# Altium schematic sheet Snap-Off.SchDoc
size A; SheetNumber: 8; SheetTotal: 8
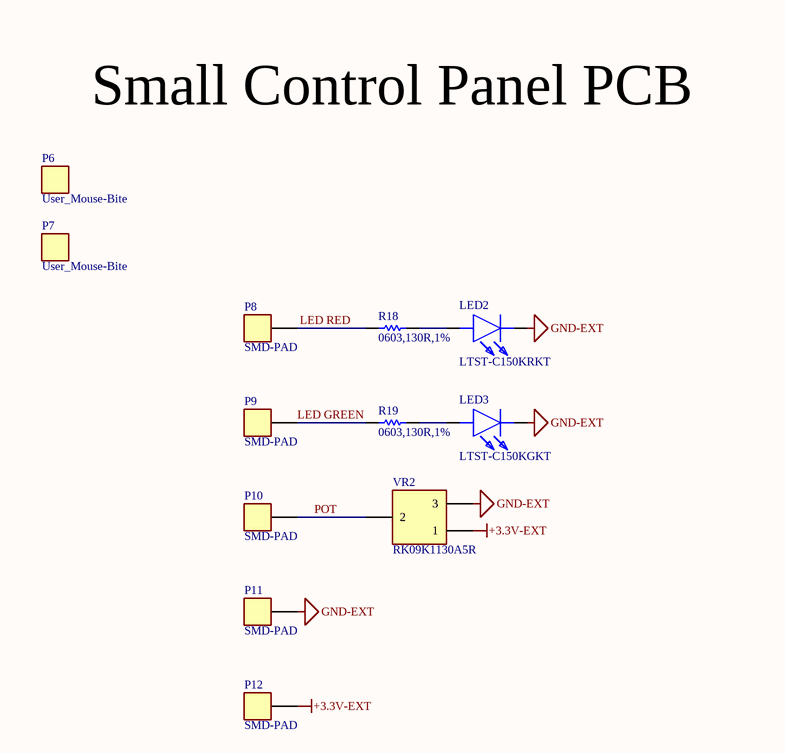
[diagram p0: Snap-Off.SchDoc]

## Parts
LED2  LTST-C150KRKT  [LEDC3216X120N]
LED3  LTST-C150KGKT  [LEDC3216X120N]
P6  User_Mouse-Bite  [mouse-bite-3mm-slot]  (no BOM)
P7  User_Mouse-Bite  [mouse-bite-3mm-slot]  (no BOM)
P8  SMD-PAD  [USER_SMD-PAD]  (no BOM)
P9  SMD-PAD  [USER_SMD-PAD]  (no BOM)
P10  SMD-PAD  [USER_SMD-PAD]  (no BOM)
P11  SMD-PAD  [USER_SMD-PAD]  (no BOM)
P12  SMD-PAD  [USER_SMD-PAD]  (no BOM)
R18  0603,130R,1%  [RESC1608X55N]
R19  0603,130R,1%  [RESC1608X55N]
VR2  RK09K1130A5R  [RES-ADJ-TH_RK09D1130C4G]

## Nets
+3.3V-EXT: P12.1 VR2.1
GND-EXT: LED2.1(K) LED3.1(K) P11.1 VR2.3
LED GREEN: P9.1 R19.1
LED RED: P8.1 R18.1
POT: P10.1 VR2.2
NetLED2_2: LED2.2(A) R18.2
NetLED3_2: LED3.2(A) R19.2

## Notes on the sheet
- (near P6) Small Control Panel PCB

## Library data of the parts
LED2 = LTST-C150KRKT: 20mA 54mcd Water Clear -30℃~+85℃ 624nm Red 130° 62.5mW 2V 1206 LED Indication - Discrete ROHS; Manufacturer_Name: Lite-On; Datasheet Link: https://optoelectronics.liteon.com/upload/download/DS-22-99-0149/LTST-C150KRKT.pdf; Height: 1.2mm; Manufacturer_Part_Number: LTST-C150KRKT; Mouser Part Number: 859-LTST-C150KRKT; Mouser Price/Stock: https://www.mouser.co.uk/ProductDetail/Lite-On/LTST-C150KRKT?qs=EfspBadgGjC5L5YGrXjS9g%3D%3D; Arrow Part Number: LTST-C150KRKT; Arrow Price/Stock: https://www.arrow.com/en/products/ltst-c150krkt/lite-on-technology?utm_currency=USD&region=nac; LCSC Part Number: C125086
LED3 = LTST-C150KGKT: 20mA 44.5mcd Water Clear -55℃~+85℃ 571nm Yellow Green 130° 75mW 2V 1206 LED Indication - Discrete ROHS; Manufacturer_Name: Lite-On; Datasheet Link: http://optoelectronics.liteon.com/upload/download/ds22-2000-072/ltst-c150kgkt.pdf; Height: 1.2mm; Manufacturer_Part_Number: LTST-C150KGKT; Mouser Part Number: 859-LTST-C150KGKT; Mouser Price/Stock: https://www.mouser.co.uk/ProductDetail/Lite-On/LTST-C150KGKT?qs=G7lFeYdtIHB%2FzaFKBwEyXw%3D%3D; Arrow Part Number: LTST-C150KGKT; Arrow Price/Stock: https://www.arrow.com/en/products/ltst-c150kgkt/lite-on-technology?utm_currency=USD&region=nac; LCSC Part Number: C125085
P6 P7 = User_Mouse-Bite: 3mm Mouse Bites
P8-P12 = SMD-PAD: SMD Pad for 18-22 AWG wire
R18 R19 = RC0603FR-07130RL: 130 Ohms ±1% 0.1W, 1/10W Chip Resistor 0603 (1608 Metric) Moisture Resistant Thick Film; Manufacturer_Name: YAGEO; Datasheet Link: https://www.mouser.com/catalog/specsheets/YAGEO_PYu_RC_Group_51_RoHS_L_12.pdf; Height: 0.55mm; Manufacturer_Part_Number: RC0603FR-07130RL; LCSC Part Number: C141677
VR2 = RK09K1130A5R: ±20% 50mW 5kΩ Through Hole Potentiometers, Variable Resistors ROHS; Manufacturer_Name: ALPS Electric; Manufacturer_Part_Number: RK09K1130AV7; Mouser Part Number: 688-RK09K1130AV7; Mouser Price/Stock: https://www.mouser.co.uk/ProductDetail/Alps-Alpine/RK09K1130AV7?qs=6EGMNY9ZYDTktmKuM5MDvw%3D%3D; LCSC Part Number: C209779